# EAGLE design Boost converter (EAGLE 9.5.2)
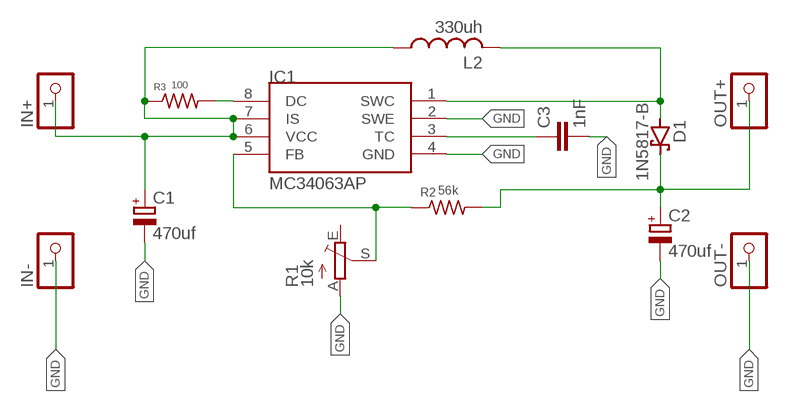
[diagram p0: schematic, sheet 1]

## Parts
C1  470uf  CAP_POL  [E3,5-8]
C2  470uf  CAP_POL  [E3,5-8]
C3  1nF  CAPACITOR  [C025-025X050]
D1  1N5817-B  [DO41-7.6]
IC1  MC34063AP  [DIL08]
IN+  PINHD-1X1  [1X01]
IN-  PINHD-1X1  [1X01]
L2  330uh  L-US0207/10  [0207/10]
OUT+  PINHD-1X1  [1X01]
OUT-  PINHD-1X1  [1X01]
R1  10k  TRIM_EU-CA6V  [CA6V]
R2  56k  RES-7  [0204/7]
R3  100  RES-7  [0204/7]

## Nets
GND: C1.- C2.- C3.2 IC1.2(SWE) IC1.4(GND) IN-.1 OUT-.1 R1.A
IN: C2.+ D1.C OUT+.1 R2.2
N$1: C1.+ IC1.6(VCC) IC1.7(IS) IN+.1 L2.1 R3.1
N$5: D1.A IC1.1(SWC) L2.2
N$6: IC1.5(FB) R1.S R2.1
N$7: C3.1 IC1.3(TC)
N$10: IC1.8(DC) R3.2
Unconnected: R1.E

## Library data of the parts
C1 C2 = MIA_LIBRARY-2-2-2:CAP_POL
C3 = MIA_LIBRARY-2-2-2:CAPACITOR
D1 = diode:1N581*: 1.0A SCHOTTKY BARRIER RECTIFIER Source: http://www.diodes.com/datasheets/ds23001.pdf
IC1 = MIA_LIBRARY-2-2-2:MC34063
IN+ IN- OUT+ OUT- = MIA_LIBRARY-2-2-2:PINHD-1X1: PIN HEADER
L2 = rcl:L-US: INDUCTOR, American symbol; SPICEPREFIX: L
R1 = MIA_LIBRARY-2-2-2:TRIM_EU-: POTENTIOMETER
R2 R3 = MIA_LIBRARY-2-2-2:RES-7

## Board
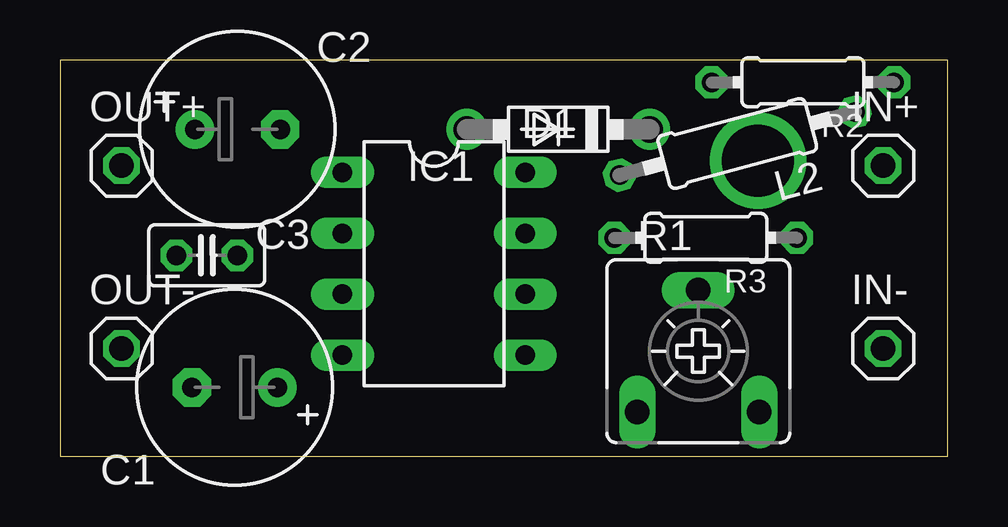
[diagram p1: board, top side]
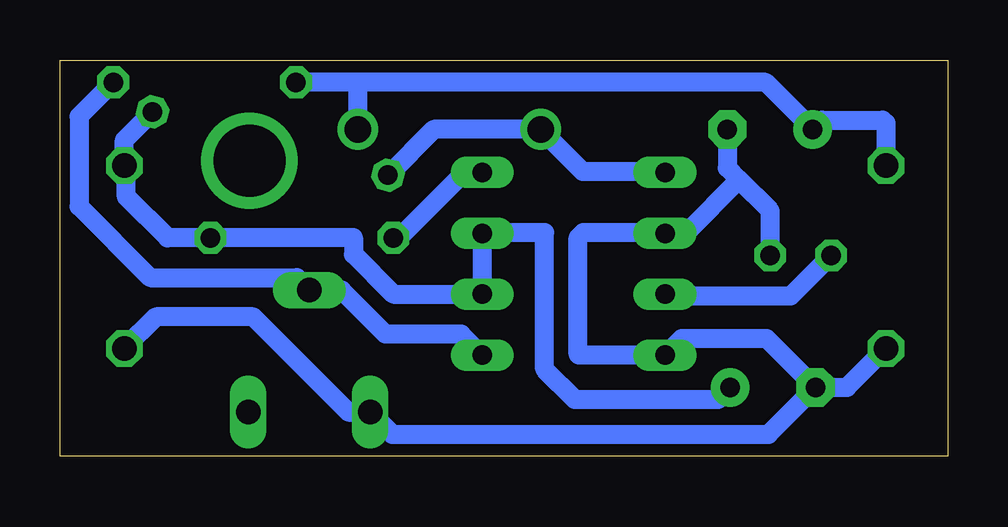
[diagram p2: board, bottom side, seen from below]

Size 37 x 16.5 mm. Coordinates in mm from the lower left corner, seen from the top.
Outline: 0,0 37,0 37,16.5 0,16.5 0,0
Copper layers (1*16): Top 0.035mm / dielectric 1.5mm / Bottom 0.035mm
Design rules "default *": minimum track width 0.1mm, minimum drill 0.35mm, track to track 0.6mm, track to pad 0.6mm, pad to pad 0.6mm, via to via 0.6mm, smd to smd 6mil, copper to edge 0.2mm, drill to drill 0.2mm, minimum pad ring 10mil, minimum via ring 8mil, stop-mask expansion 4mil, vias tented up to drill 0mil, thermal gap 10mil

### Footprints (pad centres in the part's own frame; a part is rotated, then mirrored left to right if it is on the bottom)
E3,5-8 = drill 0.813 pad 1.6: + -1.778,0 | drill 0.813 pad 1.6 octagon: - 1.778,0
C025-025X050 = drill 0.813 octagon: 1 -1.27,0; 2 1.27,0
DO41-7.6 = drill 1.1 pad 1.7: A 3.81,0; C -3.81,0
DIL08 = drill 0.813 long: 1 -3.81,-3.81; 2 -1.27,-3.81; 3 1.27,-3.81; 4 3.81,-3.81; 5 3.81,3.81; 6 1.27,3.81; 7 -1.27,3.81; 8 -3.81,3.81
1X01 = drill 1.016 octagon: 1 0,0
0207/10 = drill 0.813 octagon: 1 -5.08,0; 2 5.08,0
CA6V = drill 1.016 long: A -2.54,-2.54; E 2.54,-2.54; S 0,2.54
0204/7 = drill 0.813 octagon: 1 -3.81,0; 2 3.81,0

### Placement (x,y rotation side)
C1  7.28,2.86 180 top
C2  7.4,13.61 0 top
C3  6.12,8.36 0 top
D1  20.77,13.61 180 top
IC1  15.59,8.01 270 top
IN+  34.32,12.1 0 top
IN-  34.32,4.48 0 top
L2  28.24,13.02 195 top
OUT+  2.57,12.1 0 top
OUT-  2.57,4.48 0 top
R1  26.61,4.37 0 top
R2  30.97,15.57 180 top
R3  26.92,9.09 180 top

### Tracks (layer width: path | path; a pad name or v marks a point on that pad's centre or on a via)
GND
  Bottom 0.8: C1.- 7.54,4.9 11.08,4.9 IC1.4 15.37,4.2 15.4,4.23 15.4,9.1 15.19,9.31 11.81,9.31 | C1.- 7.46,0.9 23.14,0.9 R1.A 24.97,1.83 28.94,5.8 33,5.8 IN-.1 | C3.2 7.39,10.21 8.69,11.51 | IC1.2 11.81,9.31 | 8.69,11.51 10.89,9.31 11.81,9.31 | C1.- 4.19,2.86 OUT-.1 | C2.- 9.18,12 8.69,11.51
IN
  Bottom 0.8: OUT+.1 2.57,13.87 2.7,14 5.23,14 C2.+ 7.58,15.57 24.6,15.57 | 24.6,15.57 R2.2 | D1.C 24.58,15.55 24.6,15.57
N$1
  Bottom 0.8: C1.+ 9.56,2.36 15.54,2.36 16.8,3.62 16.8,9.31 19.37,9.31 IC1.7 IC1.6 23.11,6.74 24.77,8.4 24.77,9.1 R3.1 32.52,9.09 34.23,10.8 34.23,12.01 IN+.1 34.32,13.16 L2.1
N$2  (via drill 3 pad 4)
  other vias: 29.1,12.3
N$5
  Bottom 0.8: IC1.1 11.81,11.85 15.2,11.85 D1.A 21.42,13.61 L2.2
N$6
  Bottom 0.8: R2.1 36.2,14.15 36.2,10.4 33.23,7.43 27.13,7.43 R1.S 25.26,6.91 23.43,5.08 20.28,5.08 IC1.5
N$7
  Bottom 0.8: C3.1 6.54,6.67 11.71,6.67 IC1.3
N$10
  Bottom 0.8: R3.2 22.86,9.09 20.13,11.82 IC1.8